# Altium schematic sheet ver060_LPF.SchDoc
size A3; SheetNumber: 3; SheetTotal: 6
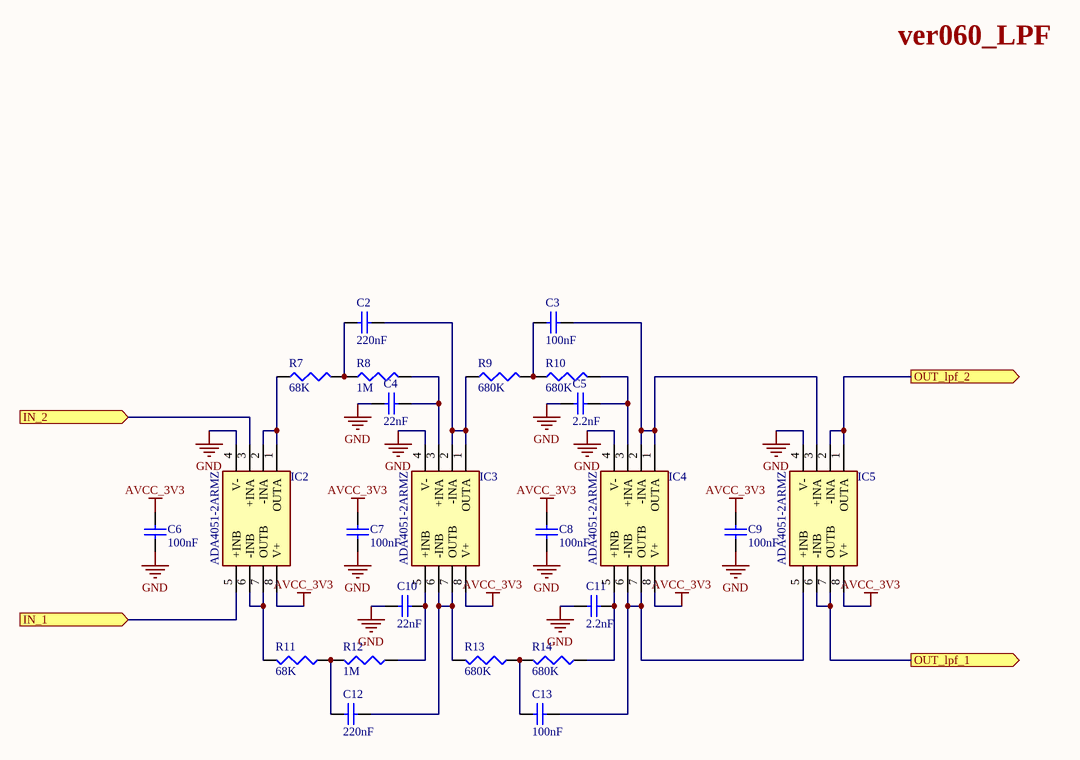
[diagram p0: ver060_LPF.SchDoc]

## Parts
C2  value 220nF  [1608[0603]]  (hidden comment: Cap Semi)
C3  value 100nF  [1608[0603]]  (hidden comment: Cap Semi)
C4  value 22nF  [1608[0603]]  (hidden comment: Cap Semi)
C5  value 2.2nF  [1608[0603]]  (hidden comment: Cap Semi)
C6  value 100nF  [1608[0603]]  (hidden comment: Cap Semi)
C7  value 100nF  [1608[0603]]  (hidden comment: Cap Semi)
C8  value 100nF  [1608[0603]]  (hidden comment: Cap Semi)
C9  value 100nF  [1608[0603]]  (hidden comment: Cap Semi)
C10  value 22nF  [1608[0603]]  (hidden comment: Cap Semi)
C11  value 2.2nF  [1608[0603]]  (hidden comment: Cap Semi)
C12  value 220nF  [1608[0603]]  (hidden comment: Cap Semi)
C13  value 100nF  [1608[0603]]  (hidden comment: Cap Semi)
IC2  ADA4051-2ARMZ  [SOP65P490X110-8N]
IC3  ADA4051-2ARMZ  [SOP65P490X110-8N]
IC4  ADA4051-2ARMZ  [SOP65P490X110-8N]
IC5  ADA4051-2ARMZ  [SOP65P490X110-8N]
R7  value 68K  [J1-0603]  (hidden comment: Res3)
R8  value 1M  [J1-0603]  (hidden comment: Res3)
R9  value 680K  [J1-0603]  (hidden comment: Res3)
R10  value 680K  [J1-0603]  (hidden comment: Res3)
R11  value 68K  [J1-0603]  (hidden comment: Res3)
R12  value 1M  [J1-0603]  (hidden comment: Res3)
R13  value 680K  [J1-0603]  (hidden comment: Res3)
R14  value 680K  [J1-0603]  (hidden comment: Res3)

## Ports
IN_1 (in), IN_2 (in), OUT_lpf_1 (out), OUT_lpf_2 (out)

## Nets
AVCC_3V3: C6.2 C7.2 C8.2 C9.2 IC2.8(V+) IC3.8(V+) IC4.8(V+) IC5.8(V+)
GND: C4.1 C5.1 C6.1 C7.1 C8.1 C9.1 C10.1 C11.1 IC2.4(V-) IC3.4(V-) IC4.4(V-) IC5.4(V-)
IN_1: IC2.5(+INB) ; port IN_1
IN_2: IC2.3(+INA) ; port IN_2
OUT_lpf_1: IC5.6(-INB) IC5.7(OUTB) ; port OUT_lpf_1
OUT_lpf_2: IC5.1(OUTA) IC5.2(-INA) ; port OUT_lpf_2
NetC2_1: C2.1 R7.1 R8.2
NetC2_2: C2.2 IC3.1(OUTA) IC3.2(-INA) R9.2
NetC3_1: C3.1 R9.1 R10.2
NetC3_2: C3.2 IC4.1(OUTA) IC4.2(-INA) IC5.3(+INA)
NetC4_2: C4.2 IC3.3(+INA) R8.1
NetC5_2: C5.2 IC4.3(+INA) R10.1
NetC10_2: C10.2 IC3.5(+INB) R12.1
NetC11_2: C11.2 IC4.5(+INB) R14.1
NetC12_1: C12.1 R11.1 R12.2
NetC12_2: C12.2 IC3.6(-INB) IC3.7(OUTB) R13.2
NetC13_1: C13.1 R13.1 R14.2
NetC13_2: C13.2 IC4.6(-INB) IC4.7(OUTB) IC5.5(+INB)
NetIC2_1: IC2.1(OUTA) IC2.2(-INA) R7.2
NetIC2_6: IC2.6(-INB) IC2.7(OUTB) R11.2

## Notes on the sheet
- ver060_LPF

## Library data of the parts
C2-C13 = Cap Semi: Capacitor (Semiconductor SIM Model); Published: 8-Jun-2000; LatestRevisionDate: 29-May-2009; LatestRevisionNote: IPC-7351 Footprint Added.; PackageReference: C1206; Publisher: Altium Limited; PackageDescription: Chip Capacitor
IC2-IC5 = ADA4051-2ARMZ: Integrated Circuit; Manufacturer_Name: Analog Devices; Datasheet Link: https://www.analog.com/media/en/technical-documentation/data-sheets/ADA4051-1_4051-2.pdf; Height: 1.1mm; Manufacturer_Part_Number: ADA4051-2ARMZ; Mouser Part Number: 584-ADA4051-2ARMZ; Mouser Price/Stock: https://www.mouser.co.uk/ProductDetail/Analog-Devices/ADA4051-2ARMZ?qs=BpaRKvA4VqGG1fnokDYZmQ%3D%3D; Arrow Part Number: ADA4051-2ARMZ; Arrow Price/Stock: https://www.arrow.com/en/products/ada4051-2armz/analog-devices?region=europe
R7-R14 = Res3: Resistor; Published: 8-Jun-2000; LatestRevisionDate: 29-May-2009; LatestRevisionNote: IPC-7351 Footprint Added.; PackageReference: J1-0603; Publisher: Altium Limited; PackageDescription: Chip Resistor